# EAGLE design DR_EIB-128_MillMax_NewParts (EAGLE 7.6.0)
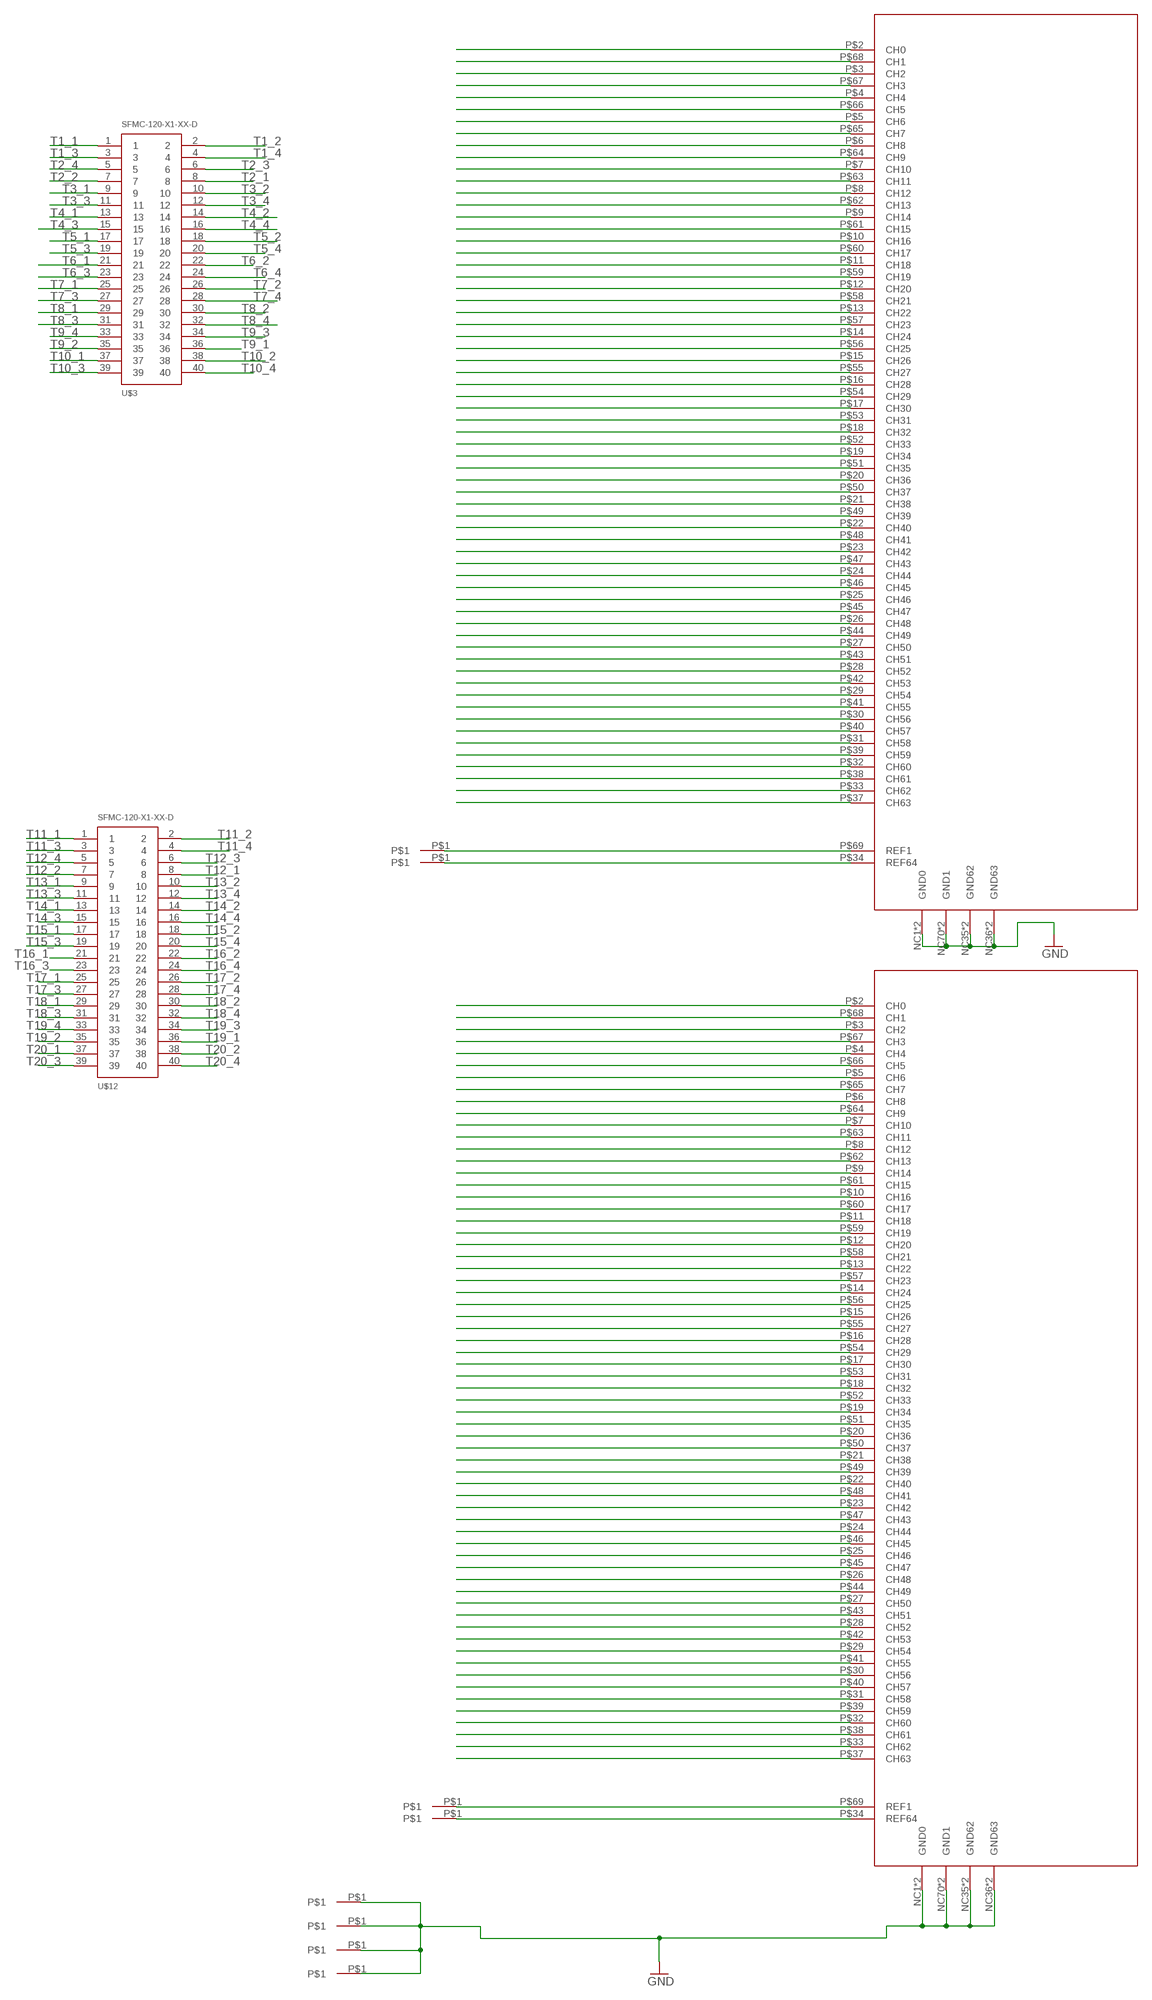
[diagram p0: schematic, sheet 1]

## Parts
U$1  TARRAYSHUTTLEHOLE  [TARRAYSHUTTLEHOLE]
U$2  TARRAYSHUTTLEHOLE  [TARRAYSHUTTLEHOLE]
U$3  SFMC-120-X1-XX-D  [SFMC-120-X1-XX-D]
U$4  TARRAYSHUTTLEHOLE  [TARRAYSHUTTLEHOLE]
U$5  TARRAYSHUTTLEHOLE  [TARRAYSHUTTLEHOLE]
U$6  TARRAYSHUTTLEHOLE  [TARRAYSHUTTLEHOLE]
U$7  TARRAYSHUTTLEHOLE  [TARRAYSHUTTLEHOLE]
U$8  TARRAYSHUTTLEHOLE  [TARRAYSHUTTLEHOLE]
U$9  TARRAYSHUTTLEHOLE  [TARRAYSHUTTLEHOLE]
U$10  HIROSE-70PIN-HEADER  [DF40C-70DP-0.4V]
U$11  HIROSE-70PIN-HEADER  [DF40C-70DP-0.4V]
U$12  SFMC-120-X1-XX-D  [SFMC-120-X1-XX-D]

## Nets
GND: U$1.P$1 U$2.P$1 U$4.P$1 U$5.P$1 U$10.NC1(GND0) U$10.NC35(GND62) U$10.NC36(GND63) U$10.NC70(GND1) U$10.P$1(GND0) U$10.P$35(GND62) U$10.P$36(GND63) U$10.P$70(GND1) U$11.NC1(GND0) U$11.NC35(GND62) U$11.NC36(GND63) U$11.NC70(GND1) U$11.P$1(GND0) U$11.P$35(GND62) U$11.P$36(GND63) U$11.P$70(GND1)
N$1: U$9.P$1 U$11.P$69(REF1)
N$2: U$8.P$1 U$11.P$34(REF64)
N$3: U$6.P$1 U$10.P$34(REF64)
N$4: U$7.P$1 U$10.P$69(REF1)
T1_1: U$3.1 U$10.P$37(CH63)
T1_2: U$3.2 U$10.P$38(CH61)
T1_3: U$3.3 U$10.P$39(CH59)
T1_4: U$3.4 U$10.P$40(CH57)
T2_1: U$3.8 U$10.P$30(CH56)
T2_2: U$3.7 U$10.P$31(CH58)
T2_3: U$3.6 U$10.P$32(CH60)
T2_4: U$3.5 U$10.P$33(CH62)
T3_1: U$3.9 U$10.P$29(CH54)
T3_2: U$3.10 U$10.P$28(CH52)
T3_3: U$3.11 U$10.P$27(CH50)
T3_4: U$3.12 U$10.P$26(CH48)
T4_1: U$3.13 U$10.P$25(CH46)
T4_2: U$3.14 U$10.P$24(CH44)
T4_3: U$3.15 U$10.P$23(CH42)
T4_4: U$3.16 U$10.P$22(CH40)
T5_1: U$3.17 U$10.P$21(CH38)
T5_2: U$3.18 U$10.P$20(CH36)
T5_3: U$3.19 U$10.P$19(CH34)
T5_4: U$3.20 U$10.P$18(CH32)
T6_1: U$3.21 U$11.P$17(CH30)
T6_2: U$3.22 U$11.P$16(CH28)
T6_3: U$3.23 U$11.P$15(CH26)
T6_4: U$3.24 U$11.P$14(CH24)
T7_1: U$3.25 U$11.P$13(CH22)
T7_2: U$3.26 U$11.P$12(CH20)
T7_3: U$3.27 U$11.P$11(CH18)
T7_4: U$3.28 U$11.P$10(CH16)
T8_1: U$3.29 U$11.P$9(CH14)
T8_2: U$3.30 U$11.P$8(CH12)
T8_3: U$3.31 U$11.P$7(CH10)
T8_4: U$3.32 U$11.P$6(CH8)
T9_1: U$3.36 U$11.P$2(CH0)
T9_2: U$3.35 U$11.P$3(CH2)
T9_3: U$3.34 U$11.P$4(CH4)
T9_4: U$3.33 U$11.P$5(CH6)
T10_1: U$3.37 U$11.P$65(CH7)
T10_2: U$3.38 U$11.P$66(CH5)
T10_3: U$3.39 U$11.P$67(CH3)
T10_4: U$3.40 U$11.P$68(CH1)
T11_1: U$11.P$37(CH63) U$12.1
T11_2: U$11.P$38(CH61) U$12.2
T11_3: U$11.P$39(CH59) U$12.3
T11_4: U$11.P$40(CH57) U$12.4
T12_1: U$11.P$30(CH56) U$12.8
T12_2: U$11.P$31(CH58) U$12.7
T12_3: U$11.P$32(CH60) U$12.6
T12_4: U$11.P$33(CH62) U$12.5
T13_1: U$11.P$29(CH54) U$12.9
T13_2: U$11.P$28(CH52) U$12.10
T13_3: U$11.P$27(CH50) U$12.11
T13_4: U$11.P$26(CH48) U$12.12
T14_1: U$11.P$25(CH46) U$12.13
T14_2: U$11.P$24(CH44) U$12.14
T14_3: U$11.P$23(CH42) U$12.15
T14_4: U$11.P$22(CH40) U$12.16
T15_1: U$11.P$21(CH38) U$12.17
T15_2: U$11.P$20(CH36) U$12.18
T15_3: U$11.P$19(CH34) U$12.19
T15_4: U$11.P$18(CH32) U$12.20
T16_1: U$10.P$17(CH30) U$12.21
T16_2: U$10.P$16(CH28) U$12.22
T16_3: U$10.P$15(CH26) U$12.23
T16_4: U$10.P$14(CH24) U$12.24
T17_1: U$10.P$13(CH22) U$12.25
T17_2: U$10.P$12(CH20) U$12.26
T17_3: U$10.P$11(CH18) U$12.27
T17_4: U$10.P$10(CH16) U$12.28
T18_1: U$10.P$9(CH14) U$12.29
T18_2: U$10.P$8(CH12) U$12.30
T18_3: U$10.P$7(CH10) U$12.31
T18_4: U$10.P$6(CH8) U$12.32
T19_1: U$10.P$2(CH0) U$12.36
T19_2: U$10.P$3(CH2) U$12.35
T19_3: U$10.P$4(CH4) U$12.34
T19_4: U$10.P$5(CH6) U$12.33
T20_1: U$10.P$65(CH7) U$12.37
T20_2: U$10.P$66(CH5) U$12.38
T20_3: U$10.P$67(CH3) U$12.39
T20_4: U$10.P$68(CH1) U$12.40
T21_1: U$11.P$64(CH9)
T21_2: U$11.P$63(CH11)
T21_3: U$11.P$62(CH13)
T21_4: U$11.P$61(CH15)
T22_1: U$11.P$60(CH17)
T22_2: U$11.P$59(CH19)
T22_3: U$11.P$58(CH21)
T22_4: U$11.P$57(CH23)
T23_1: U$11.P$56(CH25)
T23_2: U$11.P$55(CH27)
T23_3: U$11.P$54(CH29)
T23_4: U$11.P$53(CH31)
T24_1: U$11.P$52(CH33)
T24_2: U$11.P$51(CH35)
T24_3: U$11.P$50(CH37)
T24_4: U$11.P$49(CH39)
T25_1: U$11.P$48(CH41)
T25_2: U$11.P$47(CH43)
T25_3: U$11.P$46(CH45)
T25_4: U$11.P$45(CH47)
T26_1: U$11.P$44(CH49)
T26_2: U$11.P$43(CH51)
T26_3: U$11.P$42(CH53)
T26_4: U$11.P$41(CH55)
T27_1: U$10.P$64(CH9)
T27_2: U$10.P$63(CH11)
T27_3: U$10.P$62(CH13)
T27_4: U$10.P$61(CH15)
T28_1: U$10.P$60(CH17)
T28_2: U$10.P$59(CH19)
T28_3: U$10.P$58(CH21)
T28_4: U$10.P$57(CH23)
T29_1: U$10.P$56(CH25)
T29_2: U$10.P$55(CH27)
T29_3: U$10.P$54(CH29)
T29_4: U$10.P$53(CH31)
T30_1: U$10.P$52(CH33)
T30_2: U$10.P$51(CH35)
T30_3: U$10.P$50(CH37)
T30_4: U$10.P$49(CH39)
T31_1: U$10.P$48(CH41)
T31_2: U$10.P$47(CH43)
T31_3: U$10.P$46(CH45)
T31_4: U$10.P$45(CH47)
T32_1: U$10.P$44(CH49)
T32_2: U$10.P$43(CH51)
T32_3: U$10.P$42(CH53)
T32_4: U$10.P$41(CH55)

## Library data of the parts
U$1 U$2 U$4-U$9 = UsefulConnectors:TARRAYSHUTTLEHOLE
U$3 U$12 = UsefulConnectors:SFMC-120-X1-XX-D: 0.050" DOUBLE ROW SOCKET STRIP ASSEMBLY. MANUFACTURER: SAMTEC.
U$10 U$11 = UsefulConnectors:HIROSE-70PIN-HEADER

## Board
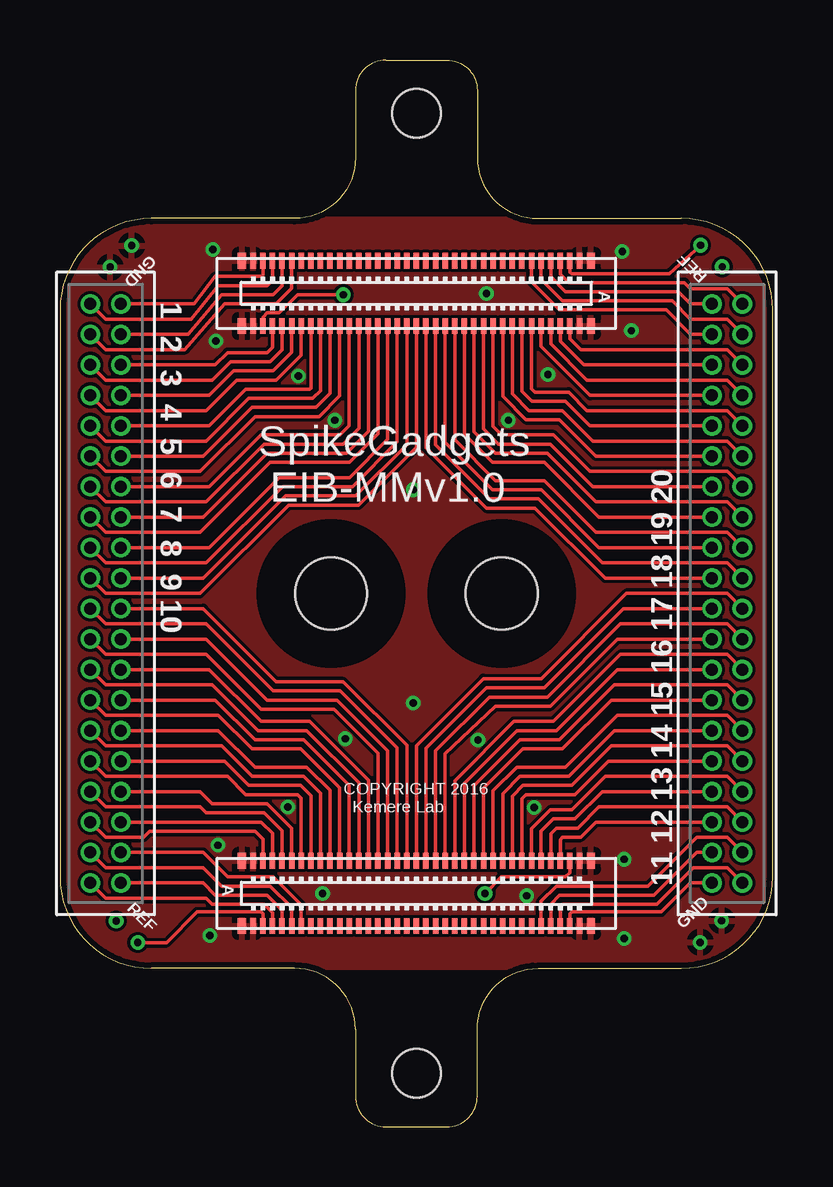
[diagram p1: board, top side]
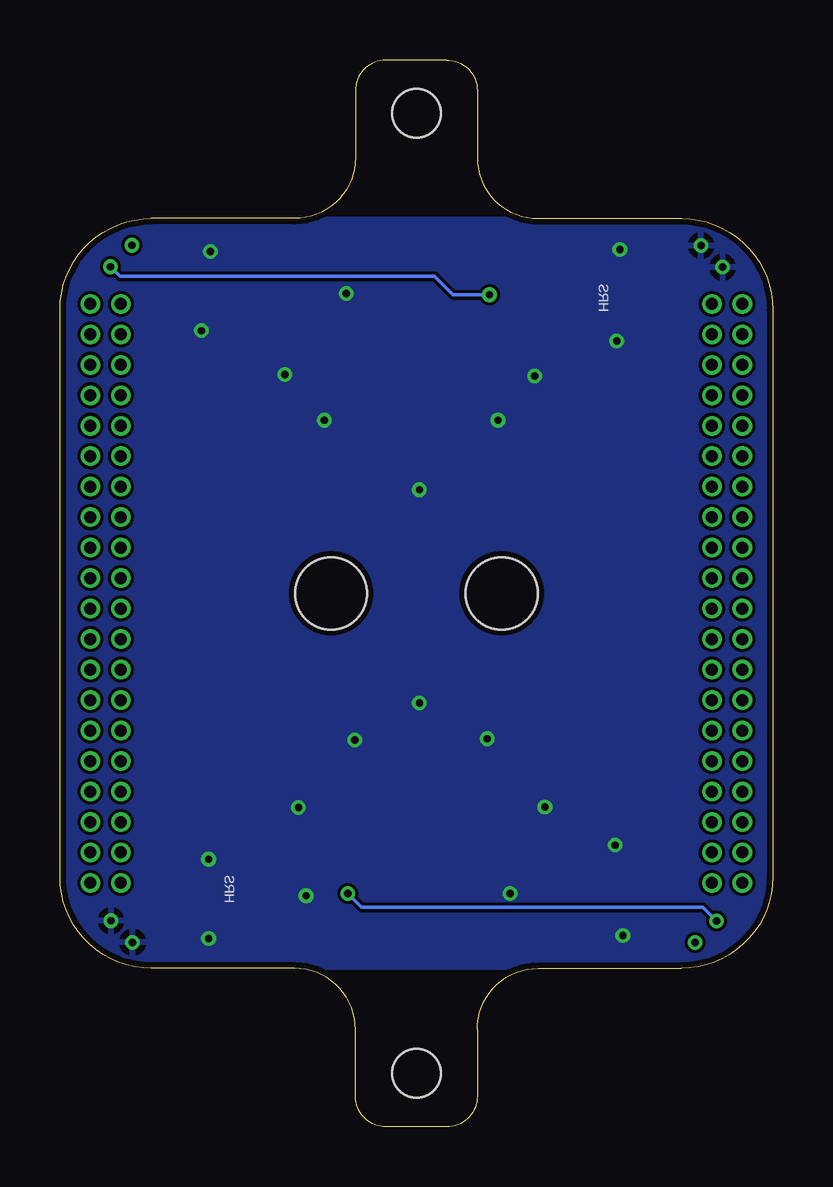
[diagram p2: board, bottom side, seen from below]

Size 29.72 x 44.45 mm. Coordinates in mm from the lower left corner, seen from the top.
Outline: 17.4,1.27 17.4,4.06 arc-90 19.94,6.6 25.91,6.6 arc90 29.72,10.41 29.72,34.04 arc90 25.91,37.85 19.94,37.85 arc-90 17.4,40.39 17.4,43.18 arc90 16.13,44.45 13.59,44.45 arc90 12.32,43.18 12.32,40.39 arc-90 9.78,37.85 3.81,37.85 arc90 0,34.04 0,10.41 arc90 3.81,6.6 9.78,6.6 arc-90 12.32,4.06 12.32,1.27 arc90 13.59,0 16.13,0 arc90 17.4,1.27
Copper layers (1*16): Top 0.035mm / dielectric 1.5mm / Bottom 0.035mm
Design rules "MF_Standard_2_Layer": minimum track width 5mil, minimum drill 12mil, track to track 5mil, track to pad 5mil, pad to pad 5mil, via to via 5mil, smd to smd 0mil, copper to edge 10mil, drill to drill 10mil, minimum pad ring 6mil, minimum via ring 6mil, stop-mask expansion 2mil, vias tented up to drill 25mil, thermal gap 10mil
Holes 3 mm at 11.3,22.23 18.41,22.23
Holes 2.03 mm at 14.86,42.23 14.86,2.23
tRestrict: area 8.4,19.3 to 14.2,25.1; area 15.5,19.3 to 21.3,25.1

### Footprints (pad centres in the part's own frame; a part is rotated, then mirrored left to right if it is on the bottom)
TARRAYSHUTTLEHOLE = drill 0.305: P$1 0,0
SFMC-120-X1-XX-D = drill 0.5 pad 0.813: 1 10.16,-0.635; 2 10.16,0.635; 3 8.89,-0.635; 4 8.89,0.635; 5 7.62,-0.635; 6 7.62,0.635; 7 6.35,-0.635; 8 6.35,0.635; 9 5.08,-0.635; 10 5.08,0.635; 11 3.81,-0.635; 12 3.81,0.635; 13 2.54,-0.635; 14 2.54,0.635; 15 1.27,-0.635; 16 1.27,0.635; 17 0,-0.635; 18 0,0.635; 19 -1.27,-0.635; 20 -1.27,0.635; 21 -2.54,-0.635; 22 -2.54,0.635; 23 -3.81,-0.635; 24 -3.81,0.635; 25 -5.08,-0.635; 26 -5.08,0.635; 27 -6.35,-0.635; 28 -6.35,0.635; 29 -7.62,-0.635; 30 -7.62,0.635; 31 -8.89,-0.635; 32 -8.89,0.635; 33 -10.16,-0.635; 34 -10.16,0.635; 35 -11.43,-0.635; 36 -11.43,0.635; 37 -12.7,-0.635; 38 -12.7,0.635; 39 -13.97,-0.635; 40 -13.97,0.635
DF40C-70DP-0.4V = smd 0.35 x 0.66: NC1 -7.275,1.355; NC35 7.275,1.355; NC36 7.275,-1.355; NC70 -7.275,-1.355 | smd 0.23 x 0.66: P$1 -6.8,1.355; P$2 -6.4,1.355; P$3 -6,1.355; P$4 -5.6,1.355; P$5 -5.2,1.355; P$6 -4.8,1.355; P$7 -4.4,1.355; P$8 -4,1.355; P$9 -3.6,1.355; P$10 -3.2,1.355; P$11 -2.8,1.355; P$12 -2.4,1.355; P$13 -2,1.355; P$14 -1.6,1.355; P$15 -1.2,1.355; P$16 -0.8,1.355; P$17 -0.4,1.355; P$18 0,1.355; P$19 0.4,1.355; P$20 0.8,1.355; P$21 1.2,1.355; P$22 1.6,1.355; P$23 2,1.355; P$24 2.4,1.355; P$25 2.8,1.355; P$26 3.2,1.355; P$27 3.6,1.355; P$28 4,1.355; P$29 4.4,1.355; P$30 4.8,1.355; P$31 5.2,1.355; P$32 5.6,1.355; P$33 6,1.355; P$34 6.4,1.355; P$35 6.8,1.355; P$36 6.8,-1.355; P$37 6.4,-1.355; P$38 6,-1.355; P$39 5.6,-1.355; P$40 5.2,-1.355; P$41 4.8,-1.355; P$42 4.4,-1.355; P$43 4,-1.355; P$44 3.6,-1.355; P$45 3.2,-1.355; P$46 2.8,-1.355; P$47 2.4,-1.355; P$48 2,-1.355; P$49 1.6,-1.355; P$50 1.2,-1.355; P$51 0.8,-1.355; P$52 0.4,-1.355; P$53 0,-1.355; P$54 -0.4,-1.355; P$55 -0.8,-1.355; P$56 -1.2,-1.355; P$57 -1.6,-1.355; P$58 -2,-1.355; P$59 -2.4,-1.355; P$60 -2.8,-1.355; P$61 -3.2,-1.355; P$62 -3.6,-1.355; P$63 -4,-1.355; P$64 -4.4,-1.355; P$65 -4.8,-1.355; P$66 -5.2,-1.355; P$67 -5.6,-1.355; P$68 -6,-1.355; P$69 -6.4,-1.355; P$70 -6.8,-1.355

### Placement (x,y rotation side)
U$1  26.69,7.69 45 top
U$2  27.59,8.58 45 top
U$3  1.91,24.13 90 top
U$4  2.99,36.72 45 top
U$5  2.09,35.82 45 top
U$6  27.61,35.84 135 top
U$7  26.71,36.73 135 top
U$8  2.34,8.58 315 top
U$9  3.24,7.68 315 top
U$10  14.86,34.73 180 top
U$11  14.86,9.72 0 top
U$12  27.81,20.32 270 top

### Tracks (layer width: path | path; a pad name or v marks a point on that pad's centre or on a via)
GND  (via drill 0.3)
  other vias: 6.38,36.55 23.44,36.47 17.42,16.12 11.9,16.17 6.25,7.98 23.52,7.85 19.77,13.31 9.5,13.32 14.73,17.65 14.73,26.54 20.35,31.34 18.69,29.44 11.46,29.44 9.93,31.28 19.46,9.63 23.52,11.15 10.95,9.72 6.5,32.74 23.83,33.17 17.78,34.72 6.58,11.73
  pour Bottom: 0,6.6 29.72,6.6 29.72,37.85 0,37.85
  pour Top: 0,6.6 29.72,6.6 29.72,37.85 0,37.85
N$1
  Top 0.152: U$9.P$1 4.44,7.68 5.71,8.95 8.38,8.95 8.46,8.88 U$11.P$69
N$2  (via drill 0.3)
  Top 0.152: U$11.P$34 21.26,10.59 21.08,10.41 18.41,10.41 v17.72,9.72
  Bottom 0.152: v17.72,9.72 17.14,9.14 2.91,9.14 U$8.P$1
N$3  (via drill 0.3)
  Top 0.152: v11.81,34.67 9.91,34.67 9.14,33.91 8.64,33.91 8.46,33.73 U$10.P$34
  Bottom 0.152: U$6.P$1 27.21,35.43 14.1,35.43 13.34,34.67 v11.81,34.67
N$4
  Top 0.152: U$7.P$1 25.41,35.53 21.34,35.53 21.26,35.61 U$10.P$69
T1_1
  Top 0.152: U$3.1 5.59,34.29 6.48,35.43 8.38,35.43 8.46,35.51 U$10.P$37
T1_2
  Top 0.152: U$3.2 1.91,33.66 5.46,33.66 6.6,35.05 8.64,35.05 8.86,35.27 U$10.P$38
T1_3
  Top 0.152: U$3.3 5.33,33.02 6.73,34.67 8.89,34.67 9.26,35.04 U$10.P$39
T1_4
  Top 0.152: U$3.4 1.91,32.38 5.21,32.38 6.86,34.29 9.02,34.29 9.66,34.93 U$10.P$40
T2_1
  Top 0.152: U$10.P$30 10.06,32.16 9.02,31.11 7.37,31.11 6.1,29.84 1.91,29.84 U$3.8
T2_2
  Top 0.152: U$10.P$31 9.66,32.27 8.89,31.5 7.24,31.5 6.22,30.48 U$3.7
T2_3
  Top 0.152: U$10.P$32 9.26,32.37 8.76,31.88 7.11,31.88 6.35,31.11 1.91,31.11 U$3.6
T2_4
  Top 0.152: U$10.P$33 8.86,32.48 8.64,32.26 6.99,32.26 6.48,31.75 U$3.5
T3_1
  Top 0.152: U$3.9 6.22,29.21 7.75,30.73 10.41,30.73 10.46,30.78 U$10.P$29
T3_2
  Top 0.152: U$3.10 1.91,28.57 6.1,28.57 7.87,30.35 10.54,30.35 10.86,30.67 U$10.P$28
T3_3
  Top 0.152: U$3.11 5.97,27.94 8,29.97 10.67,29.97 11.26,30.56 U$10.P$27
T3_4
  Top 0.152: U$3.12 1.91,27.3 5.84,27.3 8.13,29.59 10.79,29.59 11.66,30.45 U$10.P$26
T4_1
  Top 0.152: U$3.13 6.22,26.67 8.38,28.83 11.68,28.83 12.06,29.2 U$10.P$25
T4_2
  Top 0.152: U$3.14 1.91,26.04 6.1,26.04 8.51,28.45 11.81,28.45 12.46,29.1 U$10.P$24
T4_3
  Top 0.152: U$3.15 5.97,25.4 8.64,28.07 11.94,28.07 12.86,28.99 U$10.P$23
T4_4
  Top 0.152: U$3.16 1.91,24.77 5.84,24.77 8.76,27.69 12.06,27.69 13.26,28.88 U$10.P$22
T5_1
  Top 0.152: U$3.17 6.22,24.13 9.14,27.05 12.06,27.05 13.66,28.64 U$10.P$21
T5_2
  Top 0.152: U$3.18 1.91,23.5 6.1,23.5 9.27,26.67 12.19,26.67 14.06,28.54 U$10.P$20
T5_3
  Top 0.152: U$3.19 5.97,22.86 9.4,26.29 12.32,26.29 14.46,28.43 U$10.P$19
T5_4
  Top 0.152: U$3.20 1.91,22.23 5.84,22.23 9.53,25.91 12.45,25.91 14.86,28.32 U$10.P$18
T6_1
  Top 0.152: U$3.21 5.97,21.59 9.02,18.54 11.81,18.54 14.46,15.89 U$11.P$17
T6_2
  Top 0.152: U$3.22 1.91,20.95 6.1,20.95 8.89,18.16 11.68,18.16 14.06,15.79 U$11.P$16
T6_3
  Top 0.152: U$3.23 6.1,20.32 8.64,17.78 11.56,17.78 13.66,15.68 U$11.P$15
T6_4
  Top 0.152: U$3.24 1.91,19.68 6.1,19.68 8.38,17.4 11.43,17.4 13.26,15.57 U$11.P$14
T7_1
  Top 0.152: U$3.25 6.22,19.05 8.38,16.89 10.41,16.89 12.86,14.45 U$11.P$13
T7_2
  Top 0.152: U$3.26 1.91,18.41 6.35,18.41 8.26,16.51 10.29,16.51 12.46,14.34 U$11.P$12
T7_3
  Top 0.152: U$3.27 6.48,17.78 8.13,16.13 10.16,16.13 12.06,14.23 U$11.P$11
T7_4
  Top 0.152: U$3.28 1.91,17.14 6.6,17.14 8,15.75 10.03,15.75 11.66,14.12 U$11.P$10
T8_1
  Top 0.152: U$3.29 6.6,16.51 8.13,14.99 10.29,14.99 11.26,14.01 U$11.P$9
T8_2
  Top 0.152: U$3.30 1.91,15.88 6.73,15.88 8,14.61 10.16,14.61 10.86,13.91 U$11.P$8
T8_3
  Top 0.152: U$3.31 6.86,15.24 7.87,14.22 10.03,14.22 10.46,13.8 U$11.P$7
T8_4
  Top 0.152: U$3.32 1.91,14.61 6.99,14.61 7.75,13.84 9.91,13.84 10.06,13.69 U$11.P$6
T9_1
  Top 0.152: U$11.P$2 8.46,11.99 8.13,12.32 3.75,12.32 3.49,12.06 1.91,12.06 U$3.36
T9_2
  Top 0.152: U$11.P$3 8.86,12.22 8.38,12.7 U$3.35
T9_3
  Top 0.152: U$11.P$4 9.26,12.33 8.51,13.08 6.1,13.08 5.84,13.34 1.91,13.34 U$3.34
T9_4
  Top 0.152: U$11.P$5 9.66,12.44 8.64,13.46 6.35,13.46 5.84,13.97 U$3.33
T10_1
  Top 0.152: U$3.37 5.97,11.43 6.99,10.41 8.89,10.41 10.06,9.24 U$11.P$65
T10_2
  Top 0.152: U$3.38 1.91,10.79 5.97,10.79 6.73,10.03 8.76,10.03 9.65,9.14 9.65,8.76 9.66,8.76 U$11.P$66
T10_3
  Top 0.152: U$3.39 5.97,10.16 6.48,9.65 8.64,9.65 9.26,9.03 U$11.P$67
T10_4
  Top 0.152: U$3.40 1.91,9.53 6.1,9.53 6.35,9.27 8.51,9.27 8.86,8.92 U$11.P$68
T11_1
  Top 0.152: U$12.1 26.29,10.16 25.08,8.95 21.34,8.95 21.26,8.88 U$11.P$37
T11_2
  Top 0.152: U$12.2 27.81,10.79 26.42,10.79 24.89,9.27 20.95,9.27 20.86,9.18 U$11.P$38
T11_3
  Top 0.152: U$12.3 26.54,11.43 24.77,9.65 20.83,9.65 20.46,9.28 U$11.P$39
T11_4
  Top 0.152: U$12.4 27.81,12.06 26.54,12.06 24.51,10.03 20.7,10.03 20.06,9.39 U$11.P$40
T12_1
  Top 0.152: U$11.P$30 19.66,12.42 20.45,13.21 21.34,13.21 22.73,14.61 27.81,14.61 U$12.8
T12_2
  Top 0.152: U$11.P$31 20.06,12.31 20.57,12.83 21.46,12.83 22.61,13.97 U$12.7
T12_3
  Top 0.152: U$11.P$32 20.46,12.2 20.7,12.45 21.59,12.45 22.48,13.34 27.81,13.34 U$12.6
T12_4
  Top 0.152: U$11.P$33 20.86,11.97 20.95,12.06 21.72,12.06 22.35,12.7 U$12.5
T13_1
  Top 0.152: U$12.9 22.86,15.24 21.46,13.84 19.43,13.84 19.26,13.67 U$11.P$29
T13_2
  Top 0.152: U$12.10 27.81,15.88 22.99,15.88 21.34,14.22 19.3,14.22 18.86,13.78 U$11.P$28
T13_3
  Top 0.152: U$12.11 23.11,16.51 21.21,14.61 19.18,14.61 18.46,13.89 U$11.P$27
T13_4
  Top 0.152: U$12.12 27.81,17.14 23.24,17.14 21.08,14.99 19.05,14.99 18.06,13.99 U$11.P$26
T14_1
  Top 0.152: U$12.13 22.99,17.78 20.95,15.75 19.3,15.75 17.66,14.1 U$11.P$25
T14_2
  Top 0.152: U$12.14 27.81,18.41 23.11,18.41 20.83,16.13 19.18,16.13 17.26,14.21 U$11.P$24
T14_3
  Top 0.152: U$12.15 23.24,19.05 20.7,16.51 19.05,16.51 16.86,14.32 U$11.P$23
T14_4
  Top 0.152: U$12.16 27.81,19.68 23.37,19.68 20.57,16.89 18.92,16.89 16.46,14.43 U$11.P$22
T15_1
  Top 0.152: U$12.17 23.24,20.32 20.45,17.53 18.16,17.53 16.06,15.55 U$11.P$21
T15_2
  Top 0.152: U$12.18 27.81,20.95 23.37,20.95 20.32,17.91 17.91,17.91 15.66,15.66 U$11.P$20
T15_3
  Top 0.152: U$12.19 23.5,21.59 20.19,18.29 17.78,18.29 15.26,15.77 U$11.P$19
T15_4
  Top 0.152: U$12.20 27.81,22.23 23.62,22.23 20.07,18.67 17.65,18.67 14.86,15.88 U$11.P$18
T16_1
  Top 0.152: U$12.21 22.73,22.86 19.81,25.78 17.78,25.78 15.26,28.3 U$10.P$17
T16_2
  Top 0.152: U$12.22 27.81,23.5 22.61,23.5 19.94,26.16 17.91,26.16 15.66,28.41 U$10.P$16
T16_3
  Top 0.152: U$12.23 22.48,24.13 20.07,26.54 18.03,26.54 16.06,28.52 U$10.P$15
T16_4
  Top 0.152: U$12.24 27.81,24.77 22.35,24.77 20.19,26.92 18.16,26.92 16.46,28.63 U$10.P$14
T17_1
  Top 0.152: U$12.25 22.48,25.4 20.19,27.69 18.03,27.69 16.86,28.86 U$10.P$13
T17_2
  Top 0.152: U$12.26 27.81,26.04 22.35,26.04 20.32,28.07 18.16,28.07 17.26,28.97 U$10.P$12
T17_3
  Top 0.152: U$12.27 22.23,26.67 20.45,28.45 18.29,28.45 17.66,29.08 U$10.P$11
T17_4
  Top 0.152: U$12.28 27.81,27.3 22.1,27.3 20.57,28.83 18.41,28.83 18.06,29.18 U$10.P$10
T18_1
  Top 0.152: U$12.29 22.35,27.94 20.83,29.46 19.43,29.46 18.46,30.44 U$10.P$9
T18_2
  Top 0.152: U$12.30 27.81,28.57 22.23,28.57 20.95,29.84 19.56,29.84 18.86,30.54 U$10.P$8
T18_3
  Top 0.152: U$12.31 22.1,29.21 21.08,30.23 19.68,30.23 19.26,30.65 U$10.P$7
T18_4
  Top 0.152: U$12.32 27.81,29.84 21.97,29.84 21.21,30.61 19.81,30.61 19.66,30.76 U$10.P$6
T19_1
  Top 0.152: U$10.P$2 21.26,32.84 21.72,32.38 27.81,32.38 U$12.36
T19_2
  Top 0.152: U$10.P$3 20.86,32.73 21.84,31.75 U$12.35
T19_3
  Top 0.152: U$10.P$4 20.46,32.63 21.97,31.11 27.81,31.11 U$12.34
T19_4
  Top 0.152: U$10.P$5 20.06,32.52 22.1,30.48 U$12.33
T20_1
  Top 0.152: U$12.37 26.29,33.02 25.27,34.04 20.83,34.04 19.66,35.2 U$10.P$65
T20_2
  Top 0.152: U$12.38 27.81,33.66 26.29,33.66 25.53,34.42 20.95,34.42 20.06,35.31 U$10.P$66
T20_3
  Top 0.152: U$12.39 26.29,34.29 25.78,34.8 21.08,34.8 20.46,35.42 U$10.P$67
T20_4
  Top 0.152: U$12.40 27.81,34.92 26.29,34.92 26.04,35.18 21.21,35.18 20.86,35.53 U$10.P$68

### Text on the board
tPlace: GND | REF | SpikeGadgets / EIB-MMv1.0 | COPYRIGHT 2016 / Kemere Lab | REF | GND
tNames: 1 2 3 4 5 6 7 8 9 10 | 11 12 13 14 15 16 17 18 19 20